# Altium schematic sheet dac-analog.SchDoc: DAC - Analog
size Letter; CheckedBy: J. Brinton; CompanyName: Signal Laboratories, Inc.; DrawnBy: J. Brinton; Engineer: J. Brinton; Address1: 3479 Edison Way; Address2: Menlo Park CA 94025; Address3: +1 (877) 778-8435; Address4: siglabs.com; Revision: 3; SheetNumber: 26; SheetTotal: 49; ModifiedDate: 4/20/2018
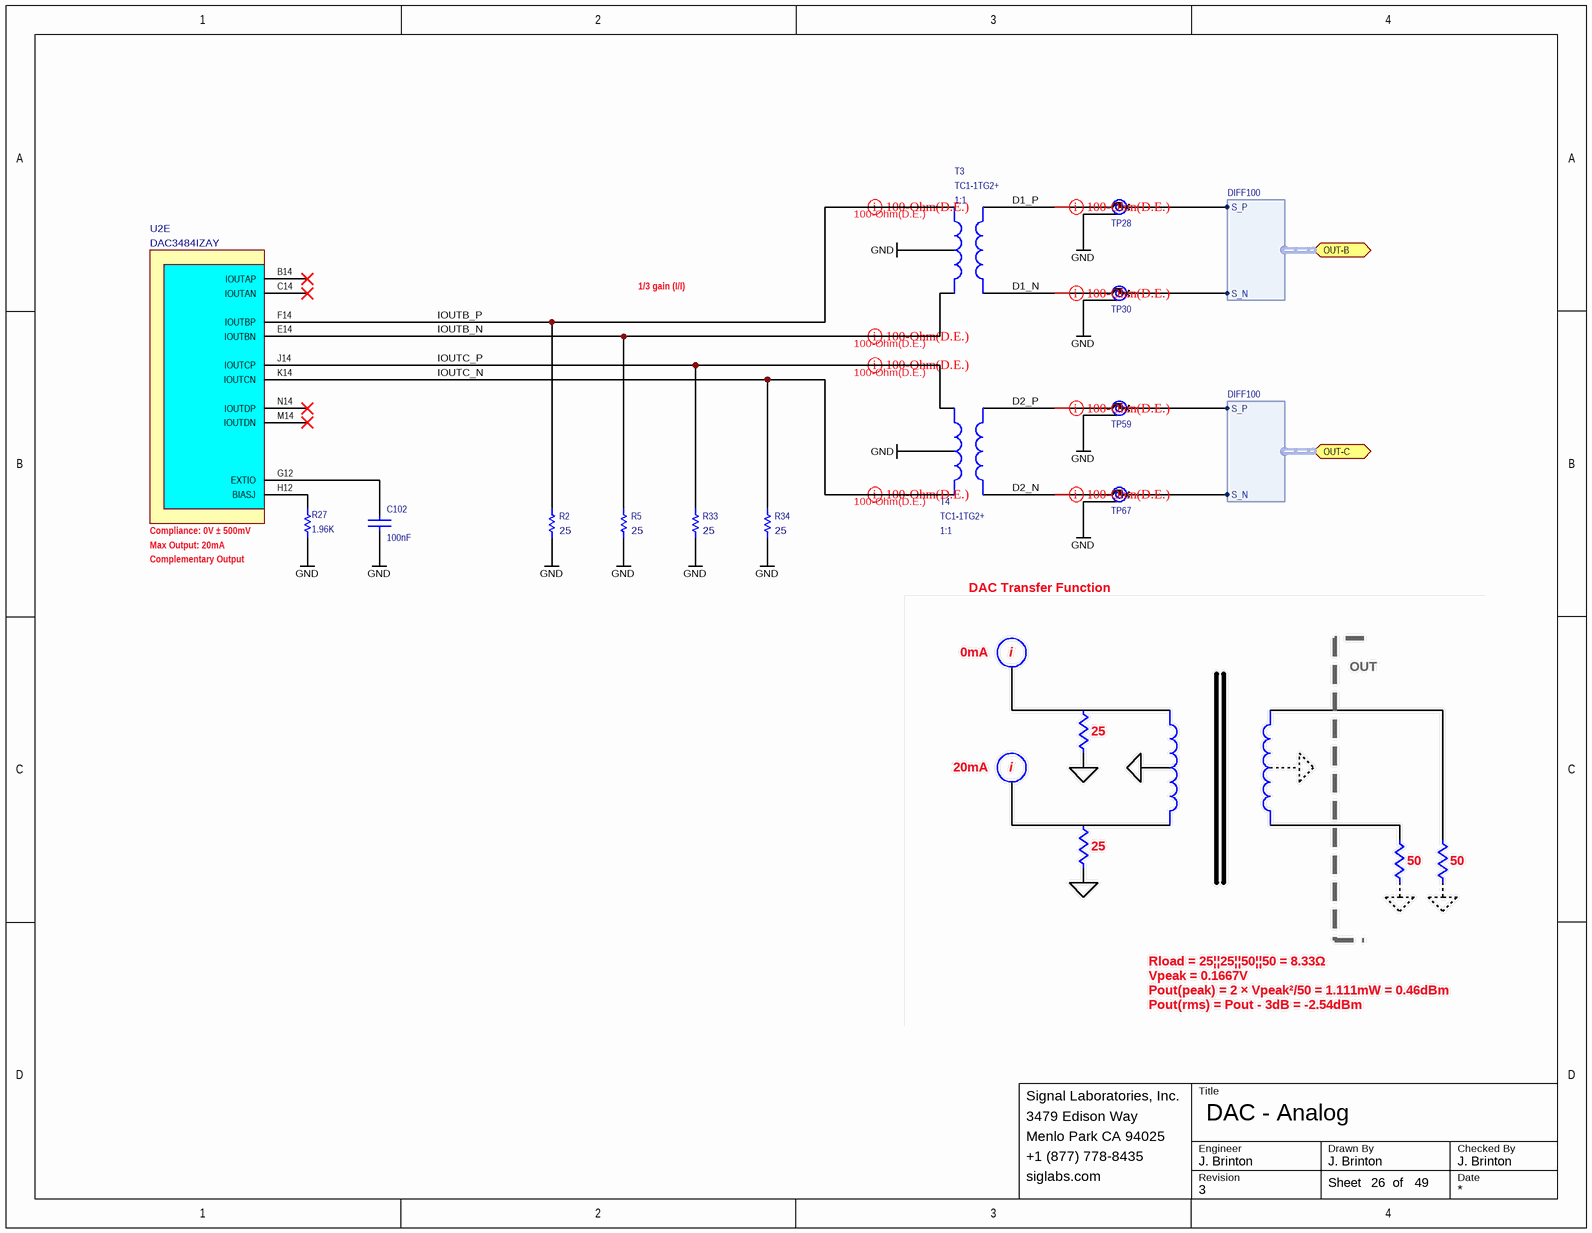
[diagram p0: dac-analog.SchDoc]

## Parts
C102  value 100nF  [CAPC100X50X55L25N]  (hidden comment: GRM155R71C104KA88J)
R2  value 25  [RESC1005X40N]  (hidden comment: FC0402E25R0BST0)
R5  value 25  [RESC1005X40N]  (hidden comment: FC0402E25R0BST0)
R27  value 1.96K  [RESC1005X40N]  (hidden comment: ERA-2AEB1961X)
R33  value 25  [RESC1005X40N]  (hidden comment: FC0402E25R0BST0)
R34  value 25  [RESC1005X40N]  (hidden comment: FC0402E25R0BST0)
T3  value 1:1  [AT224-1A]  (hidden comment: TC1-1TG2+)
T4  value 1:1  [AT224-1A]  (hidden comment: TC1-1TG2+)
TP28  MS-180(20)  [MS-180(20)]  (value not drawn)
TP30  MS-180(20)  [MS-180(20)]  (value not drawn)
TP59  MS-180(20)  [MS-180(20)]  (value not drawn)
TP67  MS-180(20)  [MS-180(20)]  (value not drawn)
U2  DAC3484IZAY  [ZAY-BGA-196]  (part E of 5)

## Ports
OUT-B (harness DIFF100), OUT-C (harness DIFF100)

## Harnesses
DIFF100: S_P, S_N

## Nets
GND: C102.1 R2.1 R5.1 R27.1 R33.1 R34.1 T3.2(SecCT) T4.2(SecCT) TP28.G(GND) TP30.G(GND) TP59.G(GND) TP67.G(GND)
D1_N: T3.4(Pri-) TP30.A(OUT)
D1_P: T3.6(Pri+) TP28.A(OUT)
D2_N: T4.6(Pri+) TP67.A(OUT)
D2_P: T4.4(Pri-) TP59.A(OUT)
IOUTB_N: R5.2 T3.3(Sec-) U2.E14(IOUTBN)
IOUTB_P: R2.2 T3.1(Sec+) U2.F14(IOUTBP)
IOUTC_N: R34.2 T4.1(Sec+) U2.K14(IOUTCN)
IOUTC_P: R33.2 T4.3(Sec-) U2.J14(IOUTCP)
NetC102_2: C102.2 U2.G12(EXTIO)
NetR27_2: R27.2 U2.H12(BIASJ)
NetTP28_C: TP28.C(IN) ; port OUT-B.S_P
NetTP30_C: TP30.C(IN) ; port OUT-B.S_N
NetTP59_C: TP59.C(IN) ; port OUT-C.S_P
NetTP67_C: TP67.C(IN) ; port OUT-C.S_N

Not connected (* = marked no-connect by the designer): U2 B14(IOUTAP)* C14(IOUTAN)* M14(IOUTDN)* N14(IOUTDP)*

## Layout directives
differential pair; net class z100diff12; Name: 100-Ohm(D.E.): IOUTB_N, IOUTB_P, IOUTC_N, IOUTC_P
differential pair; net class z100diff12; Name: 100-Ohm(D.E.); net class rf: D1_N, D1_P, D2_N, D2_P

## Notes on the sheet
- 1/3 gain (I/I)
- Compliance: 0V ± 500mV
- Max Output: 20mA
- Complementary Output
- DAC Transfer Function
- 0mA
- i
- OUT
- 25
- 20mA
- 50
- Rload = 25||25||50||50 = 8.33Ω
- Vpeak = 0.1667V
- Pout(peak) = 2 × Vpeak²/50 = 1.111mW = 0.46dBm
- Pout(rms) = Pout - 3dB = -2.54dBm
- Title
- Engineer
- Revision
- Drawn By
- Checked By
- Date
- Sheet
- of

## Library data of the parts
C102 = CAP 0402: Ceramic Capacitor 100nF ±10% 16V X7R 0402; Manufacturer: Murata; Tr: -55:125; Voltage: 16V; Manufacturer P/N: GRM155R71C104KA88J; Package: 0402; Tolerance: ±10%
R2 R5 R33 R34 = RES 0603: Thin Film Resistor 25 Ohm ±0.1% 0402; Manufacturer: Vishay; Tr: -55:155; Package: 0402; Manufacturer P/N: FC0402E25R0BST0; Do Not Place: *; Tolerance: ±0.1%
R27 = RES 0402: Thin Film Resistor 1.96k ±0.1% 0402; Manufacturer: Panasonic; Tr: -55:155; Package: 0402; Manufacturer P/N: ERA-2AEB1961X; Tolerance: ±0.1%
T3 T4 = TC1-1TG2+: RF Transformer 0.4 to 500MHz SMD; Manufacturer: Mini-Circuits; Manufacturer P/N: TC1-1TG2+
TP28 TP30 TP59 TP67 = MS-180(20): Coaxial Connector Switch; Manufacturer: Hirose; Manufacturer P/N: MS-180(20)
U2 = DAC3484IZAY: High Speed Quad DAC, 16-bit, 1.25GSPS; Manufacturer: Texas Instruments; Manufacturer P/N: DAC3484IZAY